# Altium schematic sheet Schematic File .SchDoc
size A4; DocumentNumber: 2; SheetNumber: 1
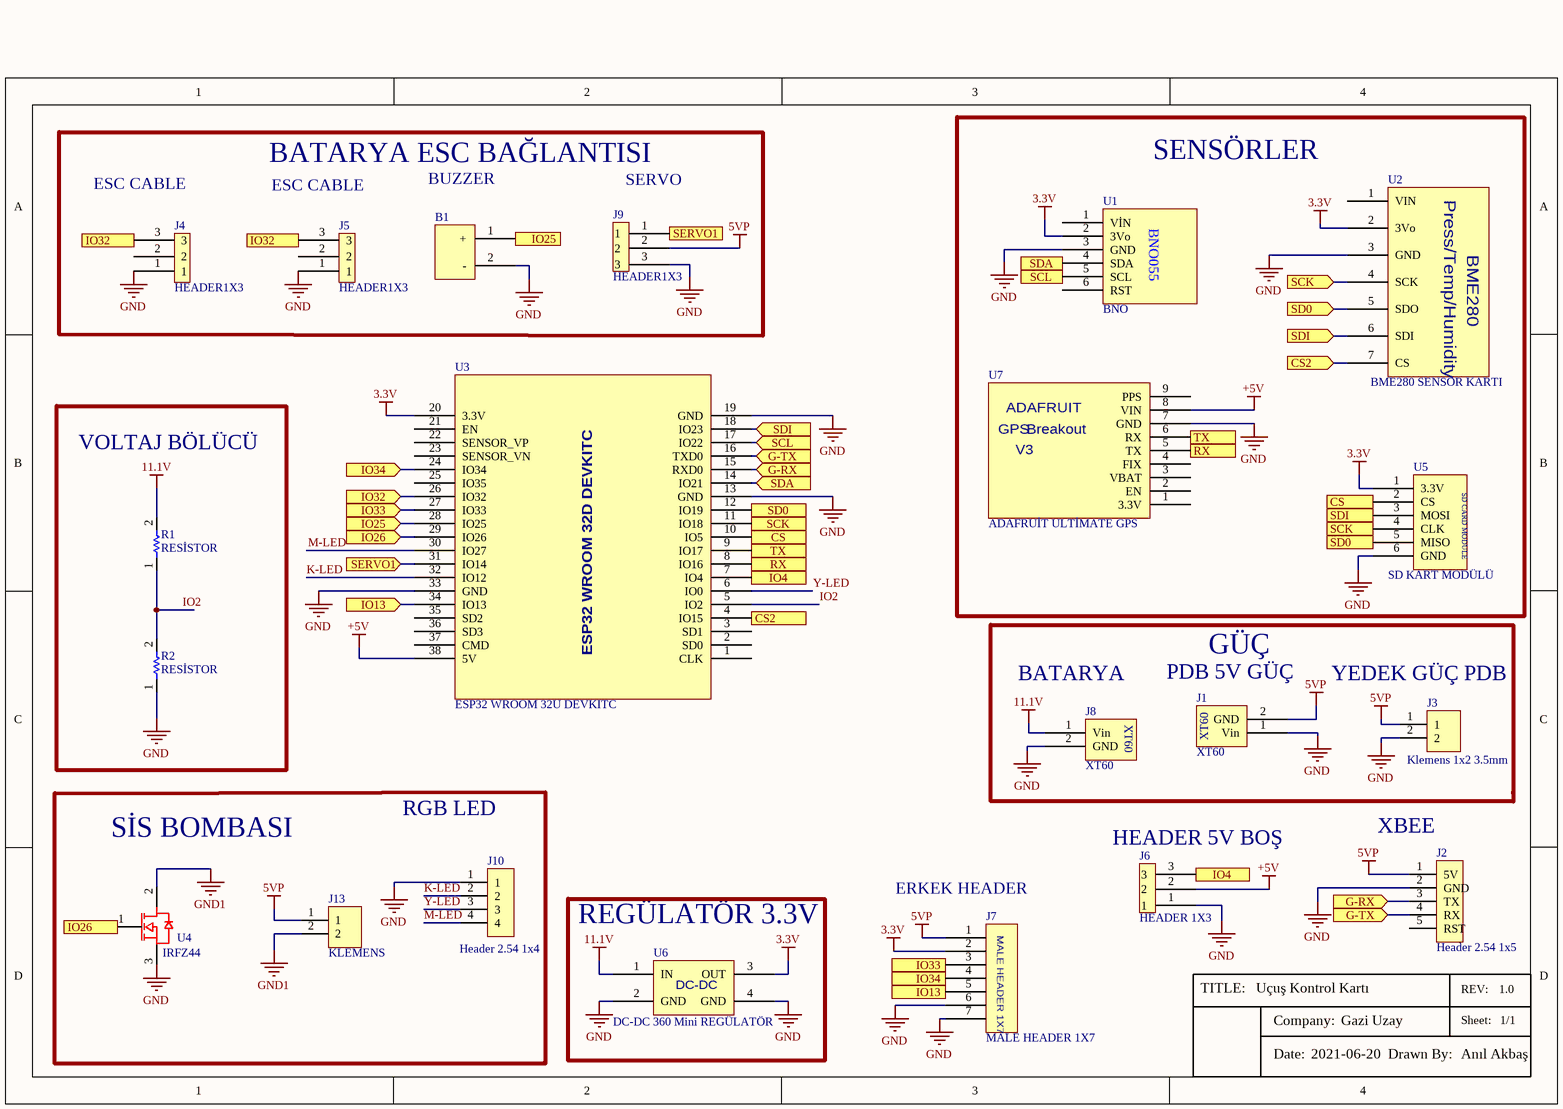
[diagram p0: Schematic File .SchDoc]

## Parts
*  TITLE  (value not drawn)
B1  BUZZER  [BUZZER 4 to 8 V]
J1  XT60  [XT60]
J2  Header 2.54 1x5  [Header 2.54 1x5]
J3  Klemens 1x2 3.5mm  [Klemens 1x2 - 3.5mm]
J4  HEADER1X3  [HEADER1X3]
J5  HEADER1X3  [HEADER1X3]
J6  HEADER 1X3  [HEADER1X3]
J7  MALE HEADER 1X7  [MALE HEADER  1X7]
J8  XT60  [XT60]
J9  HEADER1X3  [HEADER1X3]
J10  Header 2.54 1x4  [Header 2.54 1x4]
J13  KLEMENS  [Klemens 1x2 - 3.5mm]
R1  RESİSTOR  [RESİSTOR SMD]
R2  RESİSTOR  [RESİSTOR SMD]
U1  BNO  [PCBComponent_1]
U2  BME280 SENSÖR KARTI  [BME280 SENSÖR KARTI]
U3  ESP32 WROOM 32U DEVKITC  [ESP32 WROOM 32D]
U4  IRFZ44  [IRFZ44]
U5  SD KART MODÜLÜ  [SD CARD MODULE]
U6  DC-DC 360 Mini REGÜLATÖR  [DC-DC Mini 360 REGÜLATÖR KARTI]
U7  ADAFRUİT ULTİMATE GPS  [ADAFRUİT ULTİMATE GPS]

## Blocks framed on the sheet
BATARYA ESC BAĞLANTISI: B1 J4 J5 J9
SENSÖRLER: U1 U2 U5 U7
VOLTAJ BÖLÜCÜ: R1 R2
GÜÇ: J1 J3 J8
REGÜLATÖR 3.3V: U6

## Ports
CS2 (in), CS (in), G-RX (in), G-TX (in), IO4 (in), IO13 (in), IO25 (in), IO26 (in), IO32 (in), IO33 (in), IO34 (in), RX (in), SCK (in), SCL (in), SD0 (in), SDA (in), SDI (in), SERVO1 (in), TX (in)

## Nets
3.3V: J7.2 U1.2(3Vo) U2.2(3Vo) U3.20(3.3V) U5.1(3.3V) U6.3(OUT)
5VP: J1.2(GND) J2.1(5V) J3.1 J7.1 J9.2 J13.1
11.1V: J8.1(Vin) R1.2 U6.1(IN)
+5V: J6.2 U3.38(5V) U7.8(VIN)
GND: B1.2(-) J1.1(Vin) J2.2(GND) J3.2 J4.1 J5.1 J6.1 J7.6 J7.7 J8.2(GND) J9.3 J10.1 R2.1 U1.3(GND) U2.3(GND) U3.13(GND) U3.19(GND) U3.33(GND) U4.3(source) U5.6(GND) U6.2(GND) U6.4(GND) U7.7(GND)
GND1: J13.2 U4.2(drain)
CS: U3.10(IO5) U5.2(CS) ; port CS
CS2: U2.7(CS) U3.4(IO15) ; port CS2
G-RX: J2.3(TX) U3.15(RXD0) ; port G-RX
G-TX: J2.4(RX) U3.16(TXD0) ; port G-TX
IO2: R1.1 R2.2 U3.5(IO2)
IO4: J6.3 U3.7(IO4) ; port IO4
IO13: J7.5 U3.34(IO13) ; port IO13
IO25: B1.1(+) U3.28(IO25) ; port IO25
IO26: U3.29(IO26) U4.1(gate) ; port IO26
IO32: J4.3 J5.3 U3.26(IO32) ; port IO32
IO33: J7.3 U3.27(IO33) ; port IO33
IO34: J7.4 U3.24(IO34) ; port IO34
K-LED: J10.2 U3.32(IO12)
M-LED: J10.4 U3.30(IO27)
RX: U3.8(IO16) U7.5(TX) ; port RX
SCK: U2.4(SCK) U3.11(IO18) U5.4(CLK) ; port SCK
SCL: U1.5(SCL) U3.17(IO22) ; port SCL
SD0: U2.5(SDO) U3.12(IO19) U5.5(MISO) ; port SD0
SDA: U1.4(SDA) U3.14(IO21) ; port SDA
SDI: U2.6(SDI) U3.18(IO23) U5.3(MOSI) ; port SDI
SERVO1: J9.1 U3.31(IO14) ; port SERVO1
TX: U3.9(IO17) U7.6(RX) ; port TX
Y-LED: J10.3 U3.6(IO0)

Not connected (* = marked no-connect by the designer): J2 5(RST); J4 2; J5 2; U1 1(VİN) 6(RST); U2 1(VIN); U3 1(CLK) 2(SD0) 3(SD1) 21(EN) 22(SENSOR_VP) 23(SENSOR_VN) 25(IO35) 35(SD2) 36(SD3) 37(CMD); U7 1(3.3V) 2(EN) 3(VBAT) 4(FIX) 9(PPS)

## Notes on the sheet
- (near J9) SERVO
- (near J4) ESC CABLE
- (near J5) ESC CABLE
- (near J8) BATARYA
- (near J1) PDB 5V GÜÇ
- (near J3) YEDEK GÜÇ PDB
- SİS BOMBASI
- RGB LED
- (near J6) HEADER 5V BOŞ
- (near J2) XBEE
- (near J7) ERKEK HEADER
- (in symbol ADAFRUİT ULTİMATE GPS) ADAFRUIT; GPS; Breakout; V3
- (in symbol BME280 SENSÖR KARTI) Press/Temp/Humidity; BME280
- (in symbol BNO) BNO055
- (in symbol DC-DC 360 Mini REGÜLATÖR KARTI) DC-DC
- (in symbol ESP32 WROOM 32D DEVLITC) ESP32 WROOM 32D DEVKITC
- (in symbol TITLE) TITLE:; Uçuş Kontrol Kartı; REV:; 1.0; Company:; Gazi Uzay; Sheet:; 1/1; Date:; 2021-06-20; Drawn By:; Anıl Akbaş

## Library data of the parts
B1 = BUZZER 5V
J13 = Klemens 1x2 3.5mm
R1 R2 = RESİSTOR SMD
U3 = ESP32 WROOM 32D DEVLITC
U5 = SD CARD MODULE
U6 = DC-DC 360 Mini REGÜLATÖR KARTI
U7 = ADAFRUİT ULTİMATE GPS: 3.0-5.5 VDC  20mA current